# Altium schematic sheet Vertical.SchDoc
size A
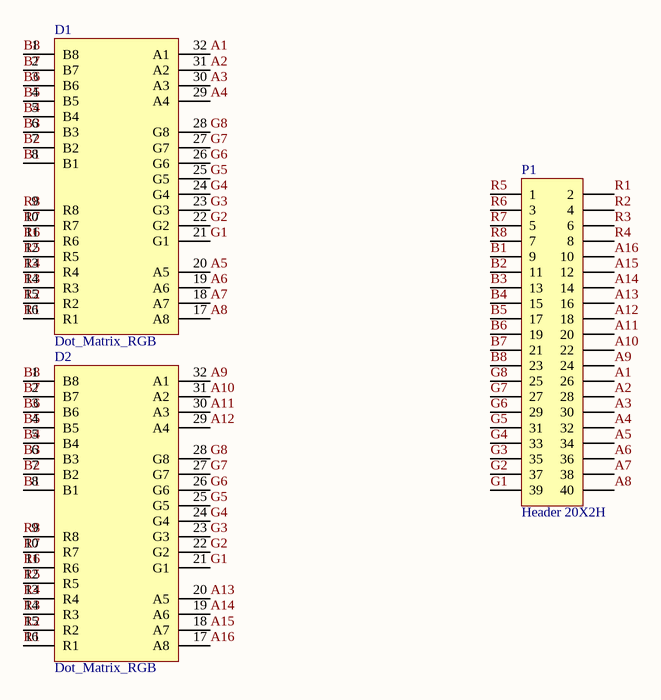
[diagram p0: Vertical.SchDoc]

## Parts
D1  Dot_Matrix_RGB  [Dot_Matrix_RGB]
D2  Dot_Matrix_RGB  [Dot_Matrix_RGB]
P1  Header 20X2H  [HDR2X20H]

## Nets
A1: D1.32(A1) P1.26
A2: D1.31(A2) P1.28
A3: D1.30(A3) P1.30
A4: D1.29(A4) P1.32
A5: D1.20(A5) P1.34
A6: D1.19(A6) P1.36
A7: D1.18(A7) P1.38
A8: D1.17(A8) P1.40
A9: D2.32(A1) P1.24
A10: D2.31(A2) P1.22
A11: D2.30(A3) P1.20
A12: D2.29(A4) P1.18
A13: D2.20(A5) P1.16
A14: D2.19(A6) P1.14
A15: D2.18(A7) P1.12
A16: D2.17(A8) P1.10
B1: D1.8(B1) D2.8(B1) P1.9
B2: D1.7(B2) D2.7(B2) P1.11
B3: D1.6(B3) D2.6(B3) P1.13
B4: D1.5(B4) D2.5(B4) P1.15
B5: D1.4(B5) D2.4(B5) P1.17
B6: D1.3(B6) D2.3(B6) P1.19
B7: D1.2(B7) D2.2(B7) P1.21
B8: D1.1(B8) D2.1(B8) P1.23
G1: D1.21(G1) D2.21(G1) P1.39
G2: D1.22(G2) D2.22(G2) P1.37
G3: D1.23(G3) D2.23(G3) P1.35
G4: D1.24(G4) D2.24(G4) P1.33
G5: D1.25(G5) D2.25(G5) P1.31
G6: D1.26(G6) D2.26(G6) P1.29
G7: D1.27(G7) D2.27(G7) P1.27
G8: D1.28(G8) D2.28(G8) P1.25
R1: D1.16(R1) D2.16(R1) P1.2
R2: D1.15(R2) D2.15(R2) P1.4
R3: D1.14(R3) D2.14(R3) P1.6
R4: D1.13(R4) D2.13(R4) P1.8
R5: D1.12(R5) D2.12(R5) P1.1
R6: D1.11(R6) D2.11(R6) P1.3
R7: D1.10(R7) D2.10(R7) P1.5
R8: D1.9(R8) D2.9(R8) P1.7

## Library data of the parts
P1 = Header 20X2H: Header, 20-Pin, Dual row, Right Angle; LatestRevisionDate: 17-Jul-2002; LatestRevisionNote: Re-released for DXP Platform.; Publisher: Altium Limited